# Altium schematic sheet chicker.SchDoc
size A4
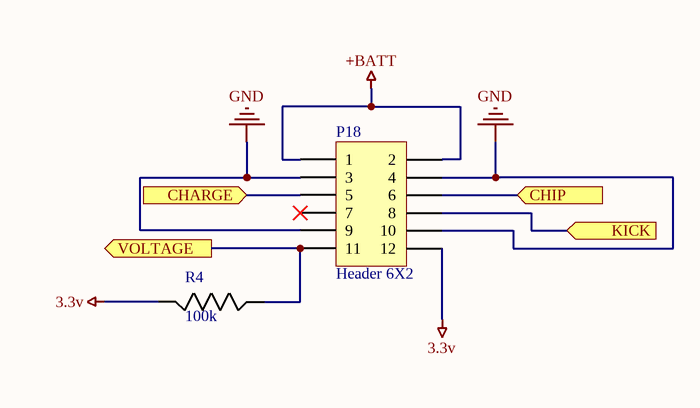
[diagram p0: chicker.SchDoc]

## Parts
P18  Header 6X2  [HDR2X6]
R4  100k  [RESC2012X60]

## Ports
CHARGE (in), CHIP (in), KICK (in), VOLTAGE (out)

## Nets
3.3v: P18.12 R4.1
+BATT: P18.1 P18.2
GND: P18.3 P18.4 P18.9 P18.10
CHARGE: P18.5 ; port CHARGE
CHIP: P18.6 ; port CHIP
KICK: P18.8 ; port KICK
VOLTAGE: P18.11 R4.2 ; port VOLTAGE

Not connected (* = marked no-connect by the designer): P18 7*

## Library data of the parts
P18 = Header 6X2: Header, 6-Pin, Dual row; LatestRevisionDate: 17-Jul-2002; LatestRevisionNote: Re-released for DXP Platform.; Publisher: Altium Limited
R4 = RC0805FR-07100RL: RES SMD 100k OHM 1% 1/8W 0805; MF: Yageo; MP: RC0805FR-07100RL; Package: 0805 Yageo; Value: *